# Altium schematic sheet KS-WL-GW-Main.SchDoc
size A4; CheckedBy: Fan mingjie; DrawnBy: Jason Huang; Address1: Buliding 5, No.1528; Address2: Gu Mei Rd HQ6; Address3: Shanghai, China; Address4: 20233; DocumentNumber: 1; Revision: 1; SheetNumber: 1; SheetTotal: 2
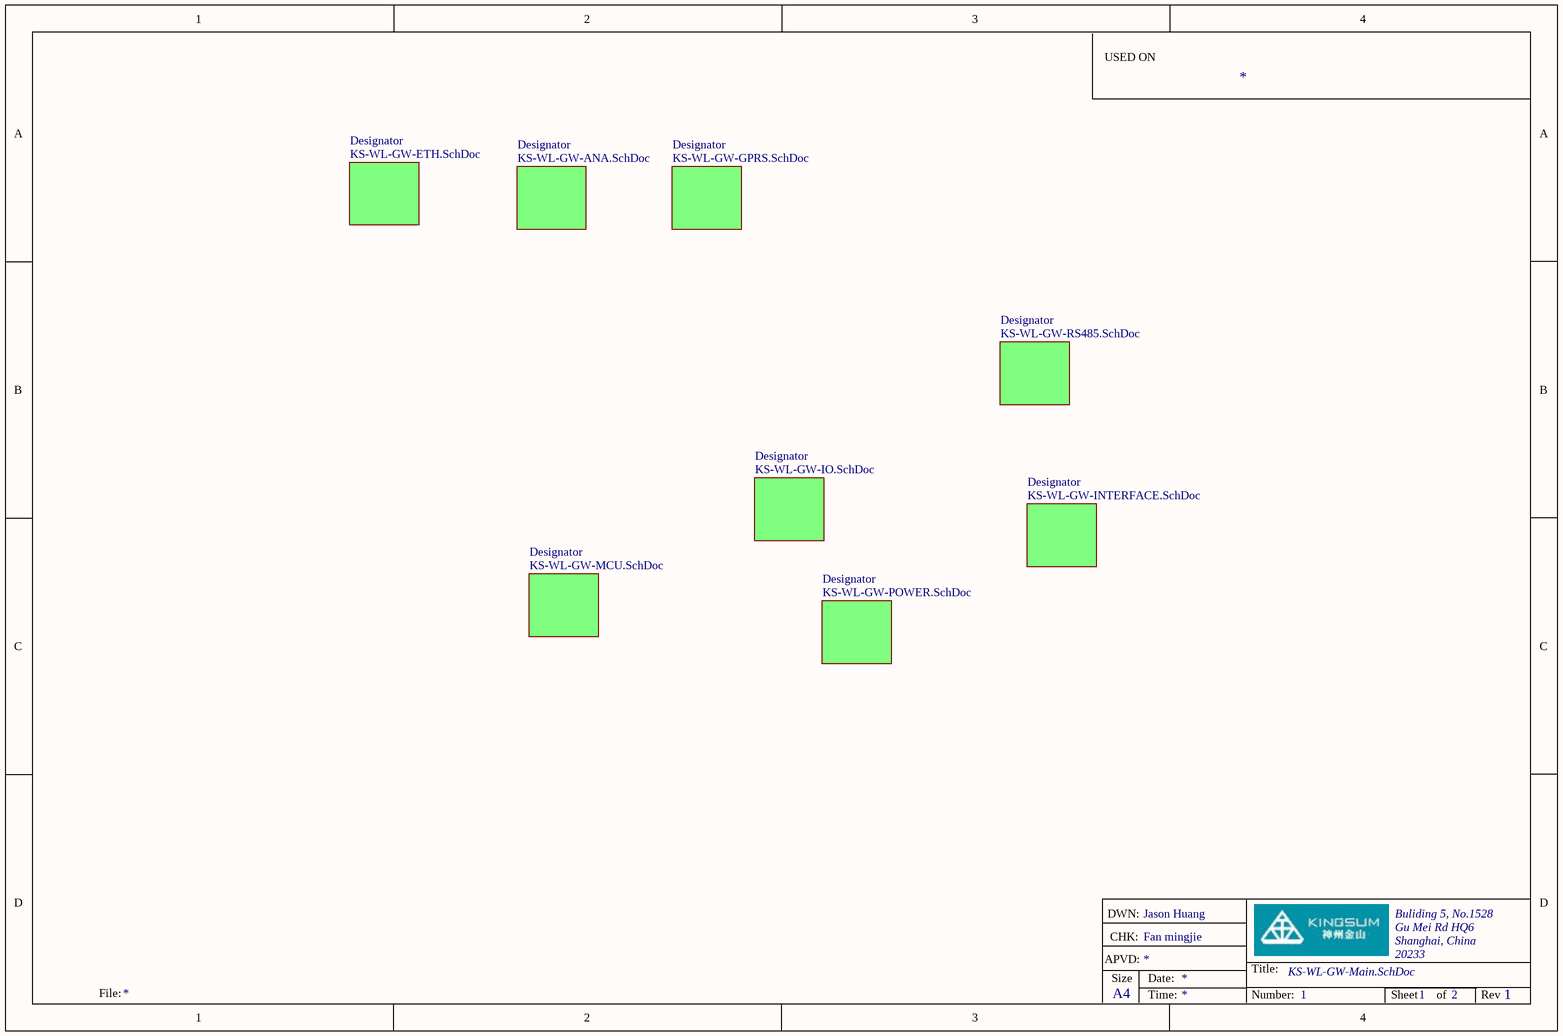
[diagram p0: KS-WL-GW-Main.SchDoc]

## Sub-sheets
Designator = KS-WL-GW-RS485.SchDoc: no entries
Designator = KS-WL-GW-ANA.SchDoc: no entries
Designator = KS-WL-GW-ETH.SchDoc: no entries
Designator = KS-WL-GW-GPRS.SchDoc: no entries
Designator = KS-WL-GW-IO.SchDoc: no entries
Designator = KS-WL-GW-POWER.SchDoc: no entries
Designator = KS-WL-GW-MCU.SchDoc: no entries
Designator = KS-WL-GW-INTERFACE.SchDoc: no entries

## Notes on the sheet
- USED ON
- DWN:
- APVD:
- CHK:
- Size
- Date:
- Title:
- File:
- A4
- Time:
- Number:
- Sheet
- of
- Rev